# Altium schematic sheet PowerSheet.SchDoc
size B; SheetNumber: 2; SheetTotal: 8
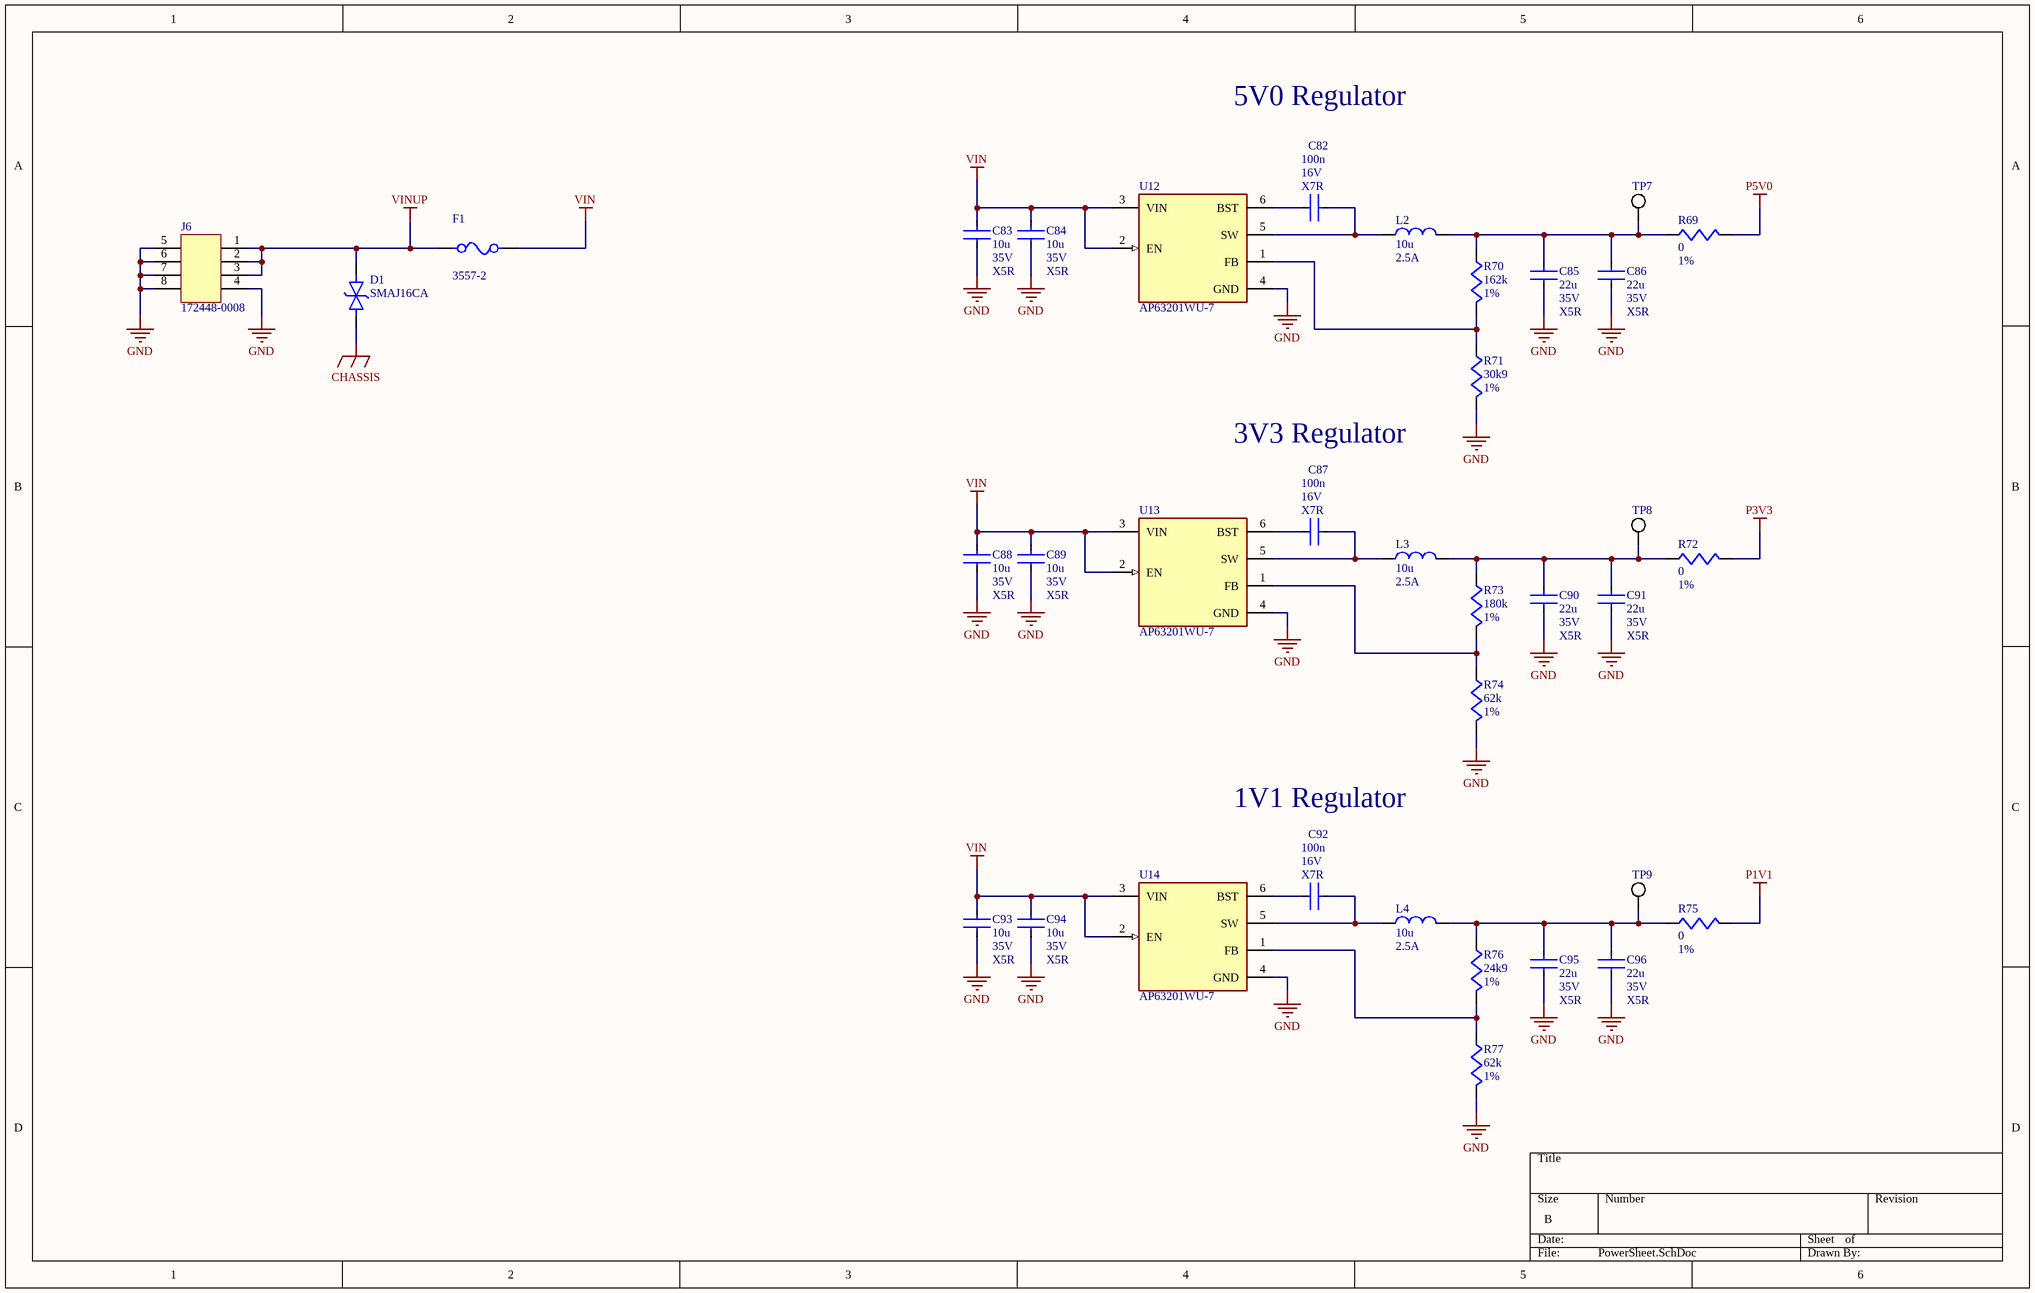
[diagram p0: PowerSheet.SchDoc]

## Parts
C82  value 100n  Voltage: 16V  Dielectric: X7R  [CAPC1005X06N]  (hidden comment: 100nF 16V 0402)
C83  value 10u  Voltage: 35V  Dielectric: X5R  [CAPC1608X08N]  (hidden comment: 10uF 35V 0603)
C84  value 10u  Voltage: 35V  Dielectric: X5R  [CAPC1608X08N]  (hidden comment: 10uF 35V 0603)
C85  value 22u  Voltage: 35V  Dielectric: X5R  [CAPC3225X18N]  (hidden comment: 22uF 35V 1210 X5R)
C86  value 22u  Voltage: 35V  Dielectric: X5R  [CAPC3225X18N]  (hidden comment: 22uF 35V 1210 X5R)
C87  value 100n  Voltage: 16V  Dielectric: X7R  [CAPC1005X06N]  (hidden comment: 100nF 16V 0402)
C88  value 10u  Voltage: 35V  Dielectric: X5R  [CAPC1608X08N]  (hidden comment: 10uF 35V 0603)
C89  value 10u  Voltage: 35V  Dielectric: X5R  [CAPC1608X08N]  (hidden comment: 10uF 35V 0603)
C90  value 22u  Voltage: 35V  Dielectric: X5R  [CAPC3225X18N]  (hidden comment: 22uF 35V 1210 X5R)
C91  value 22u  Voltage: 35V  Dielectric: X5R  [CAPC3225X18N]  (hidden comment: 22uF 35V 1210 X5R)
C92  value 100n  Voltage: 16V  Dielectric: X7R  [CAPC1005X06N]  (hidden comment: 100nF 16V 0402)
C93  value 10u  Voltage: 35V  Dielectric: X5R  [CAPC1608X08N]  (hidden comment: 10uF 35V 0603)
C94  value 10u  Voltage: 35V  Dielectric: X5R  [CAPC1608X08N]  (hidden comment: 10uF 35V 0603)
C95  value 22u  Voltage: 35V  Dielectric: X5R  [CAPC3225X18N]  (hidden comment: 22uF 35V 1210 X5R)
C96  value 22u  Voltage: 35V  Dielectric: X5R  [CAPC3225X18N]  (hidden comment: 22uF 35V 1210 X5R)
D1  SMAJ16CA  [DO-214AC]
F1  3557-2  [3557-2-Footprint-1]
J6  172448-0008  [FP-172448-0008-MFG]
L2  value 10u  Saturation Current: 2.5A  [10uH 2.5A SL0420-100M-Footprint-1]  (hidden comment: 10uH 2.5A SL0420-100M)
L3  value 10u  Saturation Current: 2.5A  [10uH 2.5A SL0420-100M-Footprint-1]  (hidden comment: 10uH 2.5A SL0420-100M)
L4  value 10u  Saturation Current: 2.5A  [10uH 2.5A SL0420-100M-Footprint-1]  (hidden comment: 10uH 2.5A SL0420-100M)
R69  value 0  Tolerance: 1%  [RESC2013X06M]  (hidden comment: 0 Ohm 1% 0805)
R70  value 162k  Tolerance: 1%  [RESC1005X04M]  (hidden comment: 162k 1% 0402)
R71  value 30k9  Tolerance: 1%  [RESC1005X04M]  (hidden comment: 30.9k 1% 0402)
R72  value 0  Tolerance: 1%  [RESC2013X06M]  (hidden comment: 0 Ohm 1% 0805)
R73  value 180k  Tolerance: 1%  [RESC1005X04M]  (hidden comment: 180k 1% 0402)
R74  value 62k  Tolerance: 1%  [RESC1005X04M]  (hidden comment: 62k 1% 0402)
R75  value 0  Tolerance: 1%  [RESC2013X06M]  (hidden comment: 0 Ohm 1% 0805)
R76  value 24k9  Tolerance: 1%  [RESC1005X04M]  (hidden comment: 24.9k 1% 0402)
R77  value 62k  Tolerance: 1%  [RESC1005X04M]  (hidden comment: 62k 1% 0402)
TP7  SMT Test Point 5015  [New footprint 1]  (value not drawn)
TP8  SMT Test Point 5015  [New footprint 1]  (value not drawn)
TP9  SMT Test Point 5015  [New footprint 1]  (value not drawn)
U12  AP63201WU-7  [FP-TSOT26-IPC_B]
U13  AP63201WU-7  [FP-TSOT26-IPC_B]
U14  AP63201WU-7  [FP-TSOT26-IPC_B]

## Nets
CHASSIS: D1.2
GND: C83.2 C84.2 C85.2 C86.2 C88.2 C89.2 C90.2 C91.2 C93.2 C94.2 C95.2 C96.2 J6.4 J6.5 J6.6 J6.7 J6.8 R71.2 R74.2 R77.2 U12.4(GND) U13.4(GND) U14.4(GND)
P1V1: R75.2
P3V3: R72.2
P5V0: R69.2
VIN: C83.1 C84.1 C88.1 C89.1 C93.1 C94.1 F1.2 U12.2(EN) U12.3(VIN) U13.2(EN) U13.3(VIN) U14.2(EN) U14.3(VIN)
VINUP: D1.1 F1.1 J6.1 J6.2 J6.3
NetC82_1: C82.1 L2.1 U12.5(SW)
NetC82_2: C82.2 U12.6(BST)
NetC85_1: C85.1 C86.1 L2.2 R69.1 R70.1 TP7.0
NetC87_1: C87.1 L3.1 U13.5(SW)
NetC87_2: C87.2 U13.6(BST)
NetC90_1: C90.1 C91.1 L3.2 R72.1 R73.1 TP8.0
NetC92_1: C92.1 L4.1 U14.5(SW)
NetC92_2: C92.2 U14.6(BST)
NetC95_1: C95.1 C96.1 L4.2 R75.1 R76.1 TP9.0
NetR70_2: R70.2 R71.1 U12.1(FB)
NetR73_2: R73.2 R74.1 U13.1(FB)
NetR76_2: R76.2 R77.1 U14.1(FB)

## Notes on the sheet
- 5V0 Regulator
- 3V3 Regulator
- 1V1 Regulator

## Library data of the parts
C82 C87 C92 = CMP-001-00088-2: 16V 100nF X7R ±10% 0402 Multilayer Ceramic Capacitors MLCC - SMD/SMT ROHS; LCSC Part #: C1525; Package: 0402
C83 C84 C88 C89 C93 C94 = CMP-001-00102-2: 35V 10uF X5R ±20% 0603 Multilayer Ceramic Capacitors MLCC - SMD/SMT ROHS; LCSC Part #: C194427; Package: 0603
C85 C86 C90 C91 C95 C96 = CMP-001-00092-2: 35V 22uF X5R ±20% 1210 Multilayer Ceramic Capacitors MLCC - SMD/SMT ROHS; Package: 1210; LCSC Part #: C778721
D1 = CMP-004-00043-1: 26V 17.8V Bidirectional 16V SMA(DO-214AC) ESD and Surge Protection (TVS/ESD) ROHS
F1 = CMP-00030-00001-1: Fuse Block 30 A 500V 1 Circuit Blade Through Hole; LCSC Part #: C19727304
J6 = CMP-002-00125-2: Rectangular Power Connector, 8 Contact(s), Male, Solder Terminal; Connector Type: Power,Rectangular; RoHS Compliant: Yes; Mounting Technology: Board
L2-L4 = CMP-006-00023-1: 2A 10uH ±20% 2.5A SMD,4.5x4.1mm Inductors (SMD) ROHS; Footprint: 4.5mmx4.1mm
R69 R72 R75 = CMP-009-00237-1: 125mW Thick Film Resistors 150V ±5% 0Ω 0805 Chip Resistor - Surface Mount ROHS; LCSC Part #: C96345; Package: 0805
R70 = CMP-009-00217-3: 62.5mW Thick Film Resistors 50V ±100ppm/℃ ±1% 162kΩ 0402 Chip Resistor - Surface Mount ROHS; LCSC Part #: C54068; Package: 0402
R71 = CMP-009-00214-2: 62.5mW Thick Film Resistors 50V ±100ppm/℃ ±1% 30.9kΩ 0402 Chip Resistor - Surface Mount ROHS; LCSC Part #: C185428; Package: 0402
R73 = CMP-009-00238-1: 62.5mW Thick Film Resistors 50V ±100ppm/℃ ±1% 180kΩ 0402 Chip Resistor - Surface Mount ROHS; LCSC Part #: C144794; Package: 0402
R74 R77 = CMP-009-00239-1: 62.5mW Thick Film Resistors 50V ±100ppm/℃ ±1% 62kΩ 0402 Chip Resistor - Surface Mount ROHS; LCSC Part #: C137950; Package: 0402
R76 = CMP-009-00200-2: 62.5mW Thick Film Resistors 50V ±100ppm/℃ ±1% 24.9kΩ 0402 Chip Resistor - Surface Mount ROHS; LCSC Part #: C25874; Package: 0402
TP7-TP9 = CMP-00030-00002-1: PC Test Point, Miniature Phosphor Bronze Silver Plating Surface Mount Mounting Type; LCSC Part #: C5199798
U12-U14 = CMP-019-00068-1: Switching Regulator; LCSC Part #: C2071044